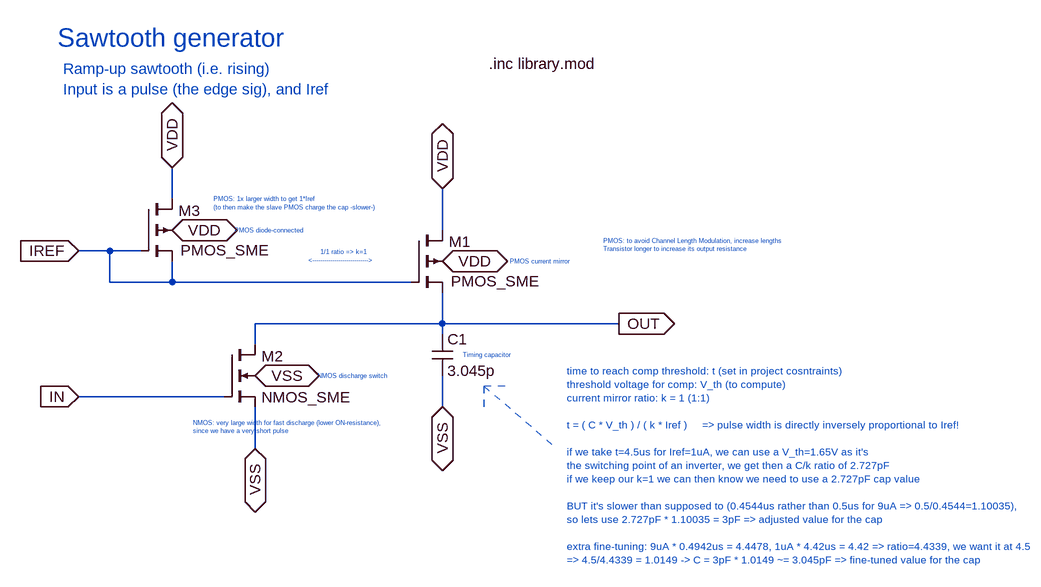
[diagram p0: schematic my_sawtooth_gen.asc]
my_sawtooth_gen.asc, the LTspice schematic file:
Version 4.1
SHEET 1 1580 1548
WIRE 80 160 80 112
WIRE 496 208 496 144
WIRE -16 240 -64 240
WIRE 32 240 -16 240
WIRE -16 288 -16 240
WIRE 80 288 80 256
WIRE 80 288 -16 288
WIRE 448 288 80 288
WIRE 496 352 496 304
WIRE 496 352 208 352
WIRE 768 352 496 352
WIRE 496 368 496 352
WIRE 208 384 208 352
WIRE 160 464 -64 464
WIRE 496 480 496 432
WIRE 208 544 208 480
FLAG -64 464 IN
IOPIN -64 464 In
FLAG -64 240 IREF
IOPIN -64 240 In
FLAG 768 352 OUT
IOPIN 768 352 Out
FLAG 80 208 VDD
IOPIN 80 208 BiDir
FLAG 496 144 VDD
IOPIN 496 144 BiDir
FLAG 496 480 VSS
IOPIN 496 480 BiDir
FLAG 208 544 VSS
IOPIN 208 544 BiDir
FLAG 208 432 VSS
IOPIN 208 432 BiDir
FLAG 80 112 VDD
IOPIN 80 112 BiDir
FLAG 496 256 VDD
IOPIN 496 256 BiDir
SYMBOL cap 480 368 R0
SYMATTR InstName C1
SYMATTR Value 3.045p
SYMBOL nmos4 160 384 R0
WINDOW 0 58 18 Left 2
WINDOW 3 58 81 Left 2
SYMATTR InstName M2
SYMATTR Value NMOS_SME
SYMATTR Value2 l=0.35u w=20u
SYMBOL pmos4 32 160 R0
WINDOW 0 58 18 Left 2
WINDOW 3 61 79 Left 2
SYMATTR InstName M3
SYMATTR Value PMOS_SME
SYMATTR Value2 l=10u w=2u
SYMBOL pmos4 448 208 R0
WINDOW 0 58 18 Left 2
WINDOW 3 61 79 Left 2
SYMATTR InstName M1
SYMATTR Value PMOS_SME
SYMATTR Value2 l=10u w=2u
TEXT -96 -88 Left 4 ;Sawtooth generator
TEXT -88 -40 Left 2 ;Ramp-up sawtooth (i.e. rising)\nInput is a pulse (the edge sig), and Iref
TEXT 600 256 Left 0 ;PMOS current mirror
TEXT 528 400 Left 0 ;Timing capacitor
TEXT 304 432 Left 0 ;NMOS discharge switch
TEXT 176 208 Left 0 ;PMOS diode-connected
TEXT 568 -48 Left 2 !.inc library.mod
TEXT 112 504 Left 0 ;NMOS: very large width for fast discharge (lower ON-resistance),\nsince we have a very short pulse
TEXT 144 160 Left 0 ;PMOS: 1x larger width to get 1*Iref\n(to then make the slave PMOS charge the cap -slower-)
TEXT 744 224 Left 0 ;PMOS: to avoid Channel Length Modulation, increase lengths\nTransistor longer to increase its output resistance
TEXT 688 424 Left 1 ;time to reach comp threshold: t (set in project cosntraints)\nthreshold voltage for comp: V_th (to compute)\ncurrent mirror ratio: k = 1 (1:1)\n \nt = ( C * V_th ) / ( k * Iref )     => pulse width is directly inversely proportional to Iref!\n \nif we take t=4.5us for Iref=1uA, we can use a V_th=1.65V as it's\nthe switching point of an inverter, we get then a C/k ratio of 2.727pF\nif we keep our k=1 we can then know we need to use a 2.727pF cap value\n \nBUT it's slower than supposed to (0.4544us rather than 0.5us for 9uA => 0.5/0.4544=1.10035),\nso lets use 2.727pF * 1.10035 = 3pF => adjusted value for the cap\n \nextra fine-tuning: 9uA * 0.4942us = 4.4478, 1uA * 4.42us = 4.42 => ratio=4.4339, we want it at 4.5\n=> 4.5/4.4339 = 1.0149 -> C = 3pF * 1.0149 ~= 3.045pF => fine-tuned value for the cap
TEXT 344 248 Center 0 ;1/1 ratio => k=1\n<---------------------------->
LINE Normal 560 448 672 544 1
LINE Normal 560 480 560 448 1
LINE Normal 560 448 560 480 2
LINE Normal 592 448 560 448 1

The netlist it stands for:
* my_sawtooth_gen.asc
C1 OUT VSS 3.045p
M2 OUT IN VSS VSS NMOS_SME l=0.35u w=20u
M3 VDD IREF IREF VDD PMOS_SME l=10u w=2u
M1 VDD IREF OUT VDD PMOS_SME l=10u w=2u
.model NMOS NMOS
.model PMOS PMOS
.lib standard.mos
* Sawtooth generator
* Ramp-up sawtooth (i.e. rising)
* Input is a pulse (the edge sig), and Iref
* PMOS current mirror
* Timing capacitor
* NMOS discharge switch
* PMOS diode-connected
.inc library.mod
* NMOS: very large width for fast discharge (lower ON-resistance),
* since we have a very short pulse
* PMOS: 1x larger width to get 1*Iref
* (to then make the slave PMOS charge the cap -slower-)
* PMOS: to avoid Channel Length Modulation, increase lengths
* Transistor longer to increase its output resistance
* time to reach comp threshold: t (set in project cosntraints)
* threshold voltage for comp: V_th (to compute)
* current mirror ratio: k = 1 (1:1)
* t = ( C * V_th ) / ( k * Iref )     => pulse width is directly inversely proportional to Iref!
* if we take t=4.5us for Iref=1uA, we can use a V_th=1.65V as it's
* the switching point of an inverter, we get then a C/k ratio of 2.727pF
* if we keep our k=1 we can then know we need to use a 2.727pF cap value
* BUT it's slower than supposed to (0.4544us rather than 0.5us for 9uA => 0.5/0.4544=1.10035),
* so lets use 2.727pF * 1.10035 = 3pF => adjusted value for the cap
* extra fine-tuning: 9uA * 0.4942us = 4.4478, 1uA * 4.42us = 4.42 => ratio=4.4339, we want it at 4.5
* => 4.5/4.4339 = 1.0149 -> C = 3pF * 1.0149 ~= 3.045pF => fine-tuned value for the cap
* 1/1 ratio => k=1
* <---------------------------->
.backanno
.end